# EAGLE design owl-digital (EAGLE 7.5.0)
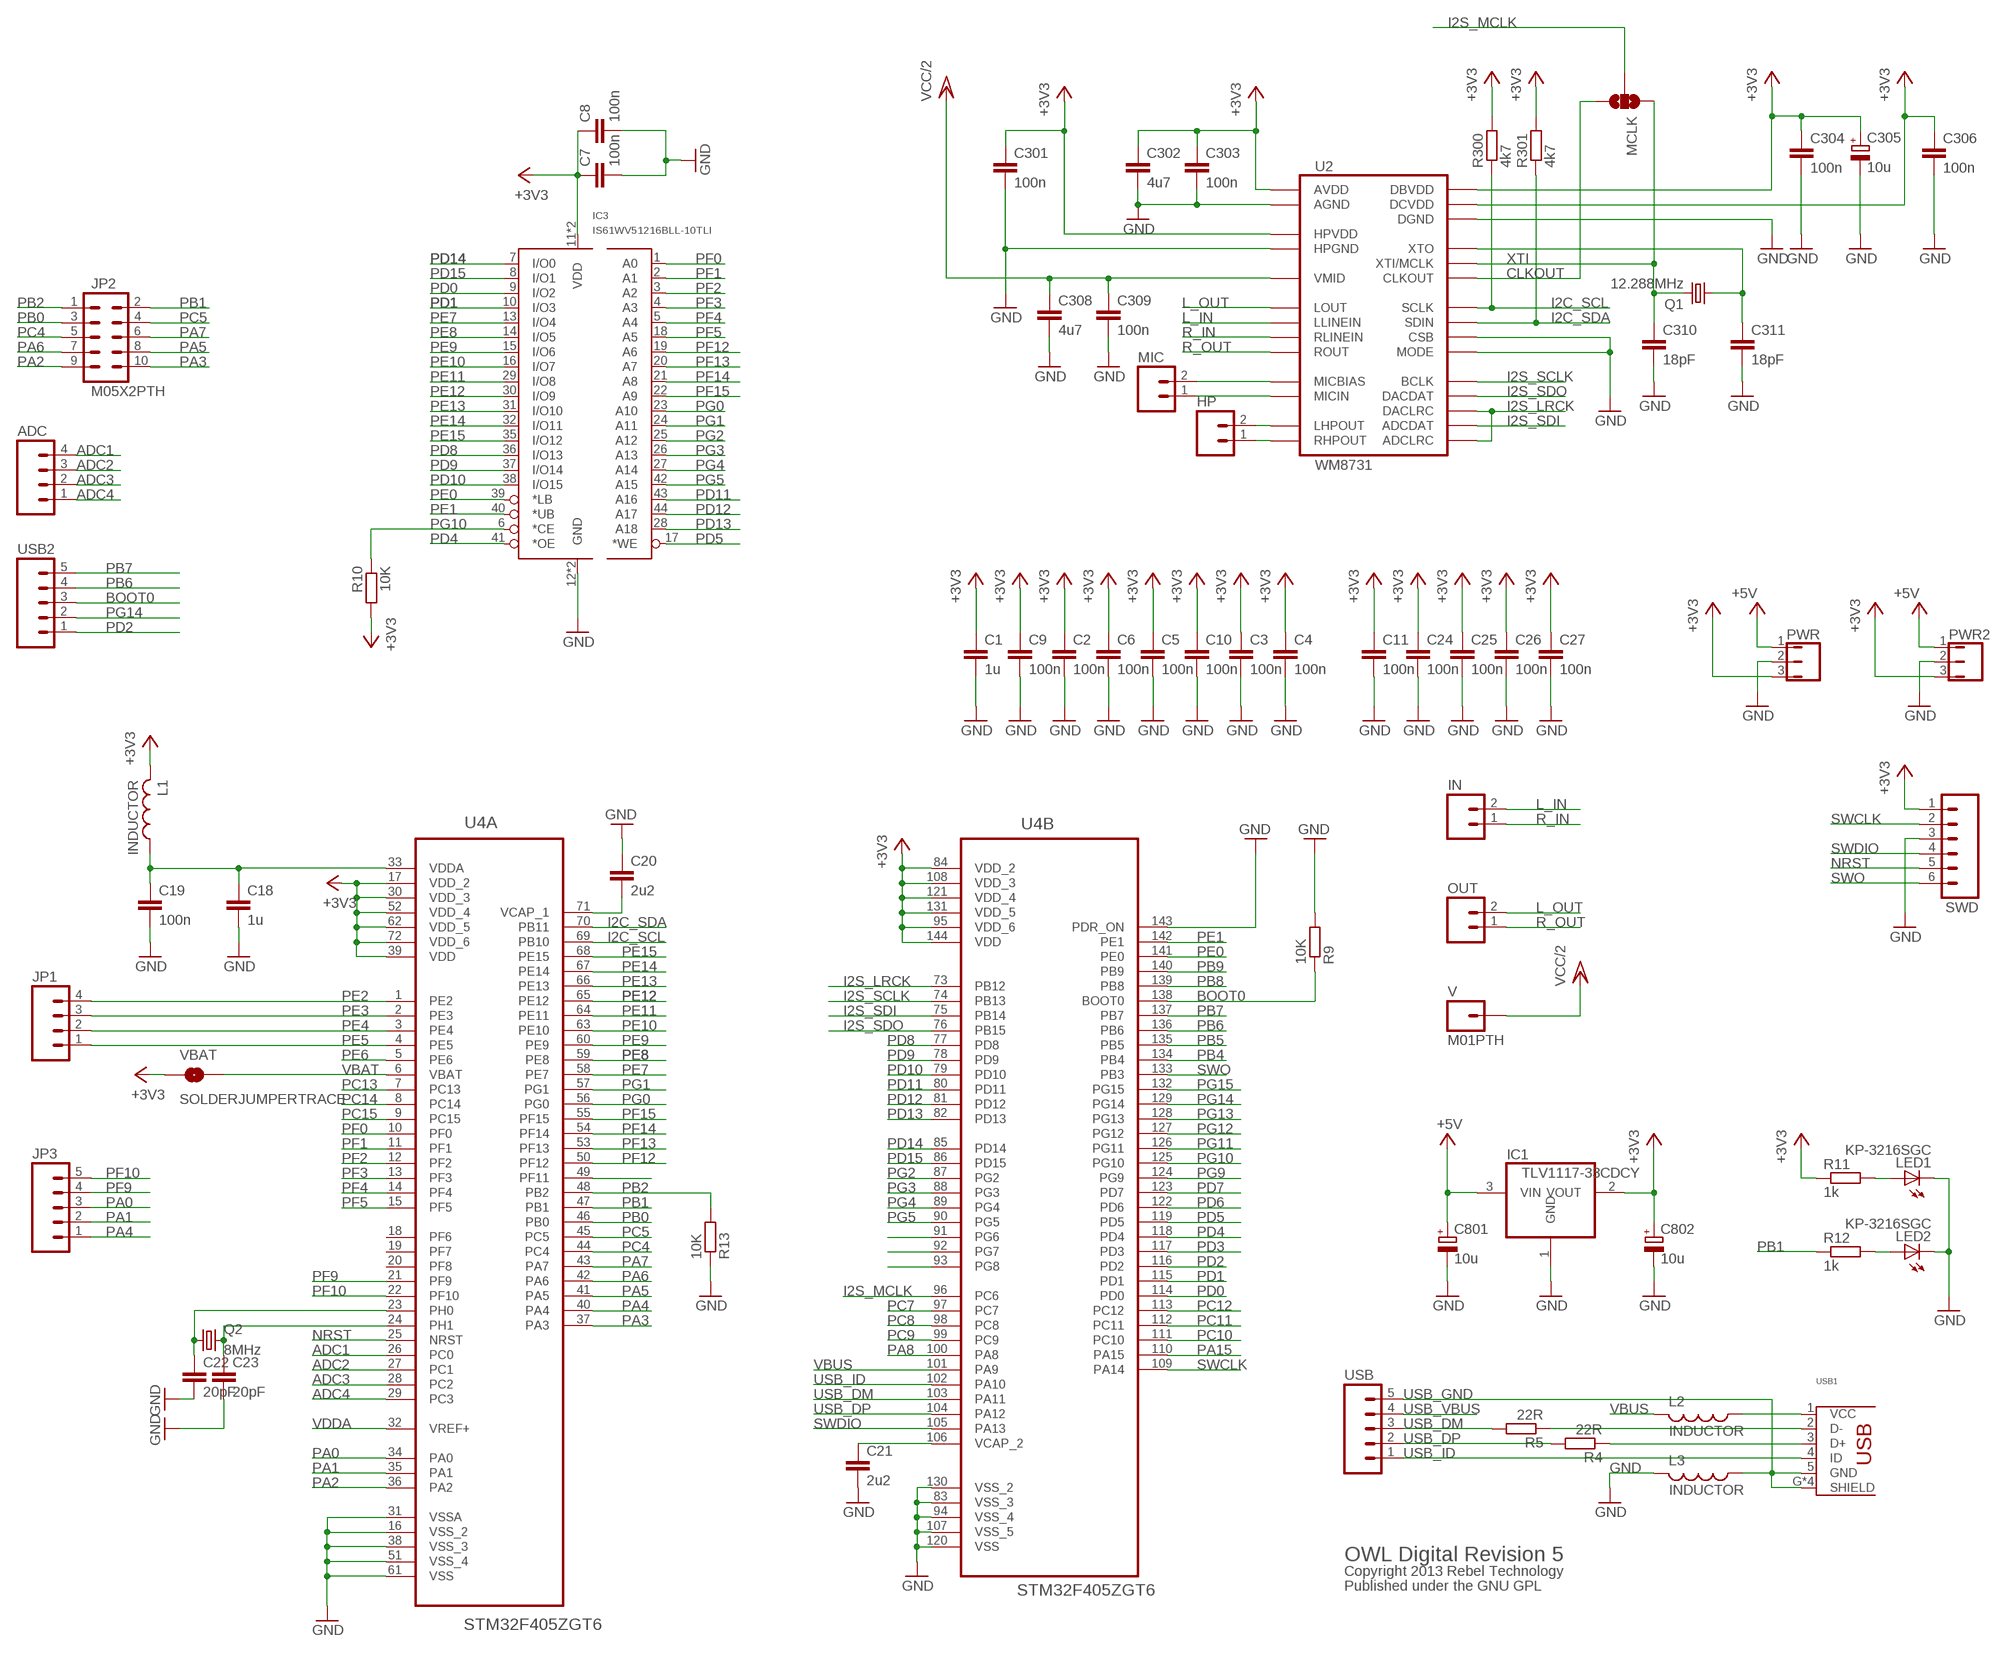
[diagram p0: schematic, sheet 1]

## Parts
ADC  M04PTH  [1X04]
C1  1u  C-EUC0603  [C0603]
C2  100n  C-EUC0603  [C0603]
C3  100n  C-EUC0603  [C0603]
C4  100n  C-EUC0603  [C0603]
C5  100n  C-EUC0603  [C0603]
C6  100n  C-EUC0603  [C0603]
C7  100n  C-EUC0603  [C0603]
C8  100n  C-EUC0603  [C0603]
C9  100n  C-EUC0603  [C0603]
C10  100n  C-EUC0603  [C0603]
C11  100n  C-EUC0603  [C0603]
C18  1u  C-EUC0603  [C0603]
C19  100n  C-EUC0603  [C0603]
C20  2u2  C-EUC0603  [C0603]
C21  2u2  C-EUC0603  [C0603]
C22  20pF  C-EUC0603  [C0603]
C23  20pF  C-EUC0603  [C0603]
C24  100n  C-EUC0603  [C0603]
C25  100n  C-EUC0603  [C0603]
C26  100n  C-EUC0603  [C0603]
C27  100n  C-EUC0603  [C0603]
C301  100n  C-EUC0603  [C0603]
C302  4u7  C-EUC1206  [C1206]
C303  100n  C-EUC0603  [C0603]
C304  100n  C-EUC0603  [C0603]
C305  10u  CPOL-EUA  [PANASONIC_A]
C306  100n  C-EUC0603  [C0603]
C308  4u7  C-EUC1206  [C1206]
C309  100n  C-EUC0603  [C0603]
C310  18pF  C-EUC0603  [C0603]
C311  18pF  C-EUC0603  [C0603]
C801  10u  CPOL-EUA  [PANASONIC_A]
C802  10u  CPOL-EUA  [PANASONIC_A]
HP  M02PTH  [1X02]
IC1  TLV1117-33CDCY  REG1117  [SOT223]
IC3  IS61WV51216BLL-10TLI  [TSOP44-II]
IN  M02PTH  [1X02]
JP1  M04PTH  [1X04]
JP2  M05X2PTH  [AVR_ICSP]
JP3  M05PTH  [1X05]
L1  INDUCTOR  [0603]
L2  INDUCTOR  [0603]
L3  INDUCTOR  [0603]
LED1  KP-3216SGC  LED1206  [LED-1206]
LED2  KP-3216SGC  LED1206  [LED-1206]
MCLK  SOLDERJUMPER_2WAY  [SJ_3_SML]
MIC  M02PTH  [1X02]
OUT  M02PTH  [1X02]
PWR  JMP/3P/SIP  [JMP/3P/SIP]
PWR2  JMP/3P/SIP  [JMP/3P/SIP]
Q1  12.288MHz  CRYSTALHC49UP  [HC49UP]
Q2  8MHz  CRYSTALHC49UP  [HC49UP]
R4  22R  R-EU_0603  [0603]
R5  22R  R-EU_0603  [0603]
R9  10K  R-EU_0603  [0603]
R10  10K  R-EU_0603  [0603]
R11  1k  R-EU_0603  [0603]
R12  1k  R-EU_0603  [0603]
R13  10K  R-EU_0603  [0603]
R300  4k7  R-EU_0603  [0603]
R301  4k7  R-EU_0603  [0603]
SWD  M06SIP  [1X06]
U2  WM8731  [28-SSOP]
U4  STM32F405ZGT6  [QFP50P2200X2200X160-144N]
USB  M05PTH  [1X05]
USB1  USB_HRS_ZX62-B-5PA(11)MICRO.B  [HRS_ZX62RD-AB-5P8]
USB2  M05PTH  [1X05]
V  M01PTH  [1X01]
VBAT  SOLDERJUMPERTRACE  [SJ_2S-TRACE]

## Nets
+3V3: C1.1 C2.1 C3.1 C4.1 C5.1 C6.1 C7.1 C8.1 C9.1 C10.1 C11.1 C24.1 C25.1 C26.1 C27.1 C301.1 C302.1 C303.1 C304.1 C305.+ C306.1 C802.+ IC1.2(VOUT) IC3.11(VDD) IC3.33(VDD) L1.2 PWR2.3 PWR.3 R10.2 R11.1 R300.2 R301.2 SWD.1 U2.P$1(DBVDD) U2.P$8(HPVDD) U2.P$14(AVDD) U2.P$27(DCVDD) U4.17(A:VDD_2) U4.30(A:VDD_3) U4.39(A:VDD) U4.52(A:VDD_4) U4.62(A:VDD_5) U4.72(A:VDD_6) U4.84(B:VDD_2) U4.95(B:VDD_6) U4.108(B:VDD_3) U4.121(B:VDD_4) U4.131(B:VDD_5) U4.144(B:VDD) VBAT.1
+5V: C801.+ IC1.3(VIN) PWR2.1 PWR.1
ADC1: ADC.4 U4.26(A:PC0)
ADC2: ADC.3 U4.27(A:PC1)
ADC3: ADC.2 U4.28(A:PC2)
ADC4: ADC.1 U4.29(A:PC3)
BOOT0: R9.1 U4.138(B:BOOT0) USB2.3
CLKOUT: MCLK.3 U2.P$2(CLKOUT)
GND: C1.2 C2.2 C3.2 C4.2 C5.2 C6.2 C7.2 C8.2 C9.2 C10.2 C11.2 C18.2 C19.2 C20.1 C21.2 C22.2 C23.2 C24.2 C25.2 C26.2 C27.2 C301.2 C302.2 C303.2 C304.2 C305.- C306.2 C308.2 C309.2 C310.2 C311.2 C801.- C802.- IC1.1(GND) IC3.12(GND) IC3.34(GND) L3.2 LED1.C LED2.C PWR2.2 PWR.2 R9.2 R13.1 SWD.3 U2.P$11(HPGND) U2.P$15(AGND) U2.P$21(MODE) U2.P$22(CSB) U2.P$28(DGND) U4.16(A:VSS_2) U4.31(A:VSSA) U4.38(A:VSS_3) U4.51(A:VSS_4) U4.61(A:VSS) U4.83(B:VSS_3) U4.94(B:VSS_4) U4.107(B:VSS_5) U4.120(B:VSS) U4.130(B:VSS_2) U4.143(B:PDR_ON)
I2C_SCL: R300.1 U2.P$24(SCLK) U4.69(A:PB10)
I2C_SDA: R301.1 U2.P$23(SDIN) U4.70(A:PB11)
I2S_LRCK: U2.P$5(DACLRC) U2.P$7(ADCLRC) U4.73(B:PB12)
I2S_MCLK: MCLK.2 U4.96(B:PC6)
I2S_SCLK: U2.P$3(BCLK) U4.74(B:PB13)
I2S_SDI: U2.P$6(ADCDAT) U4.75(B:PB14)
I2S_SDO: U2.P$4(DACDAT) U4.76(B:PB15)
L_IN: IN.2 U2.P$20(LLINEIN)
L_OUT: OUT.2 U2.P$12(LOUT)
LHPOUT: HP.2 U2.P$9(LHPOUT)
MICBIAS: MIC.2 U2.P$17(MICBIAS)
MICIN: MIC.1 U2.P$18(MICIN)
N$2: C311.1 Q1.1 U2.P$26(XTO)
N$6: U4.49(A:PF11)
N$10: LED1.A R11.2
N$11: LED2.A R12.2
N$17: R4.1 USB1.3(D+)
N$21: R5.1 USB1.2(D-)
N$23: C23.1 Q2.2 U4.24(A:PH1)
N$24: C22.1 Q2.1 U4.23(A:PH0)
N$54: U4.91(B:PG6)
N$142: U4.93(B:PG8)
N$143: U4.92(B:PG7)
NRST: SWD.5 U4.25(A:NRST)
PA0: JP3.3 U4.34(A:PA0)
PA1: JP3.2 U4.35(A:PA1)
PA2: JP2.9 U4.36(A:PA2)
PA3: JP2.10 U4.37(A:PA3)
PA4: JP3.1 U4.40(A:PA4)
PA5: JP2.8 U4.41(A:PA5)
PA6: JP2.7 U4.42(A:PA6)
PA7: JP2.6 U4.43(A:PA7)
PA8: U4.100(B:PA8)
PA15: U4.110(B:PA15)
PB0: JP2.3 U4.46(A:PB0)
PB1: JP2.2 R12.1 U4.47(A:PB1)
PB2: JP2.1 R13.2 U4.48(A:PB2)
PB4: U4.134(B:PB4)
PB5: U4.135(B:PB5)
PB6: U4.136(B:PB6) USB2.4
PB7: U4.137(B:PB7) USB2.5
PB8: U4.139(B:PB8)
PB9: U4.140(B:PB9)
PC4: JP2.5 U4.44(A:PC4)
PC5: JP2.4 U4.45(A:PC5)
PC7: U4.97(B:PC7)
PC8: U4.98(B:PC8)
PC9: U4.99(B:PC9)
PC10: U4.111(B:PC10)
PC11: U4.112(B:PC11)
PC12: U4.113(B:PC12)
PC13: U4.7(A:PC13)
PC14: U4.8(A:PC14)
PC15: U4.9(A:PC15)
PD0: IC3.9(I/O2) U4.114(B:PD0)
PD1: IC3.10(I/O3) U4.115(B:PD1)
PD2: U4.116(B:PD2) USB2.1
PD3: U4.117(B:PD3)
PD4: IC3.41(*OE) U4.118(B:PD4)
PD5: IC3.17(*WE) U4.119(B:PD5)
PD6: U4.122(B:PD6)
PD7: U4.123(B:PD7)
PD8: IC3.36(I/O13) U4.77(B:PD8)
PD9: IC3.37(I/O14) U4.78(B:PD9)
PD10: IC3.38(I/O15) U4.79(B:PD10)
PD11: IC3.43(A16) U4.80(B:PD11)
PD12: IC3.44(A17) U4.81(B:PD12)
PD13: IC3.28(A18) U4.82(B:PD13)
PD14: IC3.7(I/O0) U4.85(B:PD14)
PD15: IC3.8(I/O1) U4.86(B:PD15)
PE0: IC3.39(*LB) U4.141(B:PE0)
PE1: IC3.40(*UB) U4.142(B:PE1)
PE2: JP1.4 U4.1(A:PE2)
PE3: JP1.3 U4.2(A:PE3)
PE4: JP1.2 U4.3(A:PE4)
PE5: JP1.1 U4.4(A:PE5)
PE6: U4.5(A:PE6)
PE7: IC3.13(I/O4) U4.58(A:PE7)
PE8: IC3.14(I/O5) U4.59(A:PE8)
PE9: IC3.15(I/O6) U4.60(A:PE9)
PE10: IC3.16(I/O7) U4.63(A:PE10)
PE11: IC3.29(I/O8) U4.64(A:PE11)
PE12: IC3.30(I/O9) U4.65(A:PE12)
PE13: IC3.31(I/O10) U4.66(A:PE13)
PE14: IC3.32(I/O11) U4.67(A:PE14)
PE15: IC3.35(I/O12) U4.68(A:PE15)
PF0: IC3.1(A0) U4.10(A:PF0)
PF1: IC3.2(A1) U4.11(A:PF1)
PF2: IC3.3(A2) U4.12(A:PF2)
PF3: IC3.4(A3) U4.13(A:PF3)
PF4: IC3.5(A4) U4.14(A:PF4)
PF5: IC3.18(A5) U4.15(A:PF5)
PF9: JP3.4 U4.21(A:PF9)
PF10: JP3.5 U4.22(A:PF10)
PF12: IC3.19(A6) U4.50(A:PF12)
PF13: IC3.20(A7) U4.53(A:PF13)
PF14: IC3.21(A8) U4.54(A:PF14)
PF15: IC3.22(A9) U4.55(A:PF15)
PG0: IC3.23(A10) U4.56(A:PG0)
PG1: IC3.24(A11) U4.57(A:PG1)
PG2: IC3.25(A12) U4.87(B:PG2)
PG3: IC3.26(A13) U4.88(B:PG3)
PG4: IC3.27(A14) U4.89(B:PG4)
PG5: IC3.42(A15) U4.90(B:PG5)
PG9: U4.124(B:PG9)
PG10: IC3.6(*CE) R10.1 U4.125(B:PG10)
PG11: U4.126(B:PG11)
PG12: U4.127(B:PG12)
PG13: U4.128(B:PG13)
PG14: U4.129(B:PG14) USB2.2
PG15: U4.132(B:PG15)
R_IN: IN.1 U2.P$19(RLINEIN)
R_OUT: OUT.1 U2.P$13(ROUT)
RHPOUT: HP.1 U2.P$10(RHPOUT)
SWCLK: SWD.2 U4.109(B:PA14)
SWDIO: SWD.4 U4.105(B:PA13)
SWO: SWD.6 U4.133(B:PB3)
USB_DM: R5.2 U4.103(B:PA11) USB.3
USB_DP: R4.2 U4.104(B:PA12) USB.2
USB_GND: L3.1 USB1.5(GND) USB1.G2(SHIELD) USB1.G3(SHIELD) USB1.G4(SHIELD) USB1.G(SHIELD) USB.5
USB_ID: U4.102(B:PA10) USB1.4(ID) USB.1
USB_VBUS: L2.1 USB1.1(VCC) USB.4
VBAT: U4.6(A:VBAT) VBAT.2
VBUS: L2.2 U4.101(B:PA9)
VCAP1: C20.2 U4.71(A:VCAP_1)
VCAP2: C21.1 U4.106(B:VCAP_2)
VCC/2: C308.1 C309.1 U2.P$16(VMID) V.1
VDDA: C18.1 C19.1 L1.1 U4.32(A:VREF+) U4.33(A:VDDA)
XTI: C310.1 MCLK.1 Q1.2 U2.P$25(XTI/MCLK)
Unconnected: U4.18(A:PF6) U4.19(A:PF7) U4.20(A:PF8)

## Notes on the sheet
- OWL Digital Revision 5
- Copyright 2013 Rebel Technology
- Published under the GNU GPL

## Library data of the parts
ADC JP1 = SparkFun:M04: Header 4 Standard 4-pin 0.1" header. Use with straight break away headers (SKU : PRT-00116), right angle break away headers (PRT-00553), swiss pins (PRT-00743), machine pins (PRT-00117), and female headers (PRT-00115). Molex polarized connector foot print use with SKU : PRT-08231 with associated crimp pins and housings. 1MM SMD Version SKU: PRT-10208
C1-C11 C18 C19 C22-C27 C301-C304 C306 C308 C309 = resistor:C-EU: CAPACITOR, European symbol
C20 C21 = resistor:C-EU: CAPACITOR, European symbol; FARNELL: 184-5734
C305 = resistor:CPOL-EU: POLARIZED CAPACITOR, European symbol
C310 C311 = resistor:C-EU: CAPACITOR, European symbol; FARNELL: 182-8908
C801 C802 = resistor:CPOL-EU: POLARIZED CAPACITOR, European symbol; FARNELL: 882-3014
HP IN MIC OUT = SparkFun:M02: Header 2 Standard 2-pin 0.1" header. Use with straight break away headers (SKU : PRT-00116), right angle break away headers (PRT-00553), swiss pins (PRT-00743), machine pins (PRT-00117), and female headers (PRT-00115). Molex polarized connector foot print use with SKU : PRT-08233 with associated crimp pins and housings.
IC1 = burr-brown:REG1117: 800mA and 1A Low Dropout (LDO) Positive Regulator 1.8V, 2.5V, 2.85V, 3.3V, 5V, and Adj; FARNELL: 149-4942; MPN: REG1117; OC_FARNELL: 1097566; OC_NEWARK: 14P6981
IC3 = Rebel:IS61WV51216BLL-10TLI: IS61WV51216BLL-10TLI - SRAM, 8MBIT, 10NS, 44TSOPII Manufacturer: INTEGRATED SILICON SOLUTION (ISSI) Farnell order code: 2253837 Manufacturer Part No: IS61WV51216BLL-10TLI Product Information SRAM, 8MBIT, 10NS, 44TSOPII Memory Size: 8Mbit Memory Configuration: 512K x 16bit Supply Voltage Min: 2.4V Supply Voltage Max: 3.6V Memory Case Style: TSOPII No. of Pins: 44 Access Time: 10ns Operating Temperature Min: -40°C Operating Temperature Max: 85°C MSL: MSL 3 - 168 hours SVHC: No SVHC (19-Dec-2012) Operating Temperature Range: -40°C to +85°C Supply Voltage Range: 2.4V to 3.6V; FARNELL: 225-3837
JP2 = SparkFun:M05X2: Header 5x2 Standard 10-pin dual row 0.1" header. Commonly used with AVR-ISP. Use with Spark Fun Electronics SKU: PRT-00778
JP3 USB USB2 = SparkFun:M05: Header 5 Standard 5-pin 0.1" header. Use with straight break away headers (SKU : PRT-00116), right angle break away headers (PRT-00553), swiss pins (PRT-00743), machine pins (PRT-00117), and female headers (PRT-00115). Molex polarized connector foot print use with SKU : PRT-08230 with associated crimp pins and housings.
L1 = Rebel:INDUCTOR; FARNELL: 161-1981
L2 L3 = Rebel:INDUCTOR
LED1 LED2 = SparkFun:LED: LEDs Standard schematic elements and footprints for 5mm, 3mm, 1206, and 0603 sized LEDs. 5mm - Spark Fun Electronics SKU : COM-00529 (and others); FARNELL: 853-0033
MCLK = SparkFun:SOLDERJUMPER_2WAY: Solder Jumper 2 way solder jumper
PWR PWR2 = audioint:JMP/3P/SIP
Q1 = crystal:CRYSTAL: CRYSTAL; FARNELL: 184-2283; OC_FARNELL: unknown; OC_NEWARK: unknown
Q2 = crystal:CRYSTAL: CRYSTAL; FARNELL: 206-3972; OC_FARNELL: unknown; OC_NEWARK: unknown
R4 R5 R9-R13 R300 R301 = Rebel:R-EU_: RESISTOR, European symbol
SWD = SparkFun:M06: Header 6 Standard 6-pin 0.1" header. Use with straight break away headers (SKU : PRT-00116), right angle break away headers (PRT-00553), swiss pins (PRT-00743), machine pins (PRT-00117), and female headers (PRT-00115). Molex polarized connector foot print use with SKU : PRT-08094 with associated crimp pins and housings. NOTES ON THE VARIANTS LOCK and LOCK_LONGPADS... This footprint was designed to help hold the alignment of a through-hole component (i.e. 6-pin header) while soldering it into place. You may notice that each hole has been shifted either up or down by 0.005 of an inch from it's more standard position (which is a perfectly straight line). This slight alteration caused the pins (the squares in the middle) to touch the edges of the holes. Because they are alternating, it causes a "brace" to hold the component in place. 0.005 has proven to be the perfect amount of "off-center" position when using our standard breakaway headers. Although looks a little odd when you look at the bare footprint, once you have a header in there, the alteration is very hard to notice. Also, if you push a header all the way into place, it is covered up entirely on the bottom side. This idea of altering the position of holes to aid alignment will be further integrated into the Sparkfun Library for other footprints. It can help hold any component with 3 or more connection pins.
U2 = audioint:WM8731; FARNELL: 177-6264
U4 = Rebel:STM32F405ZGT6: IC, MCU, 32BIT, 1MB FLASH, 144LQFP; FARNELL: 221-5225; MPN: STM32F405ZGT6; OC_FARNELL: 2215225; OC_NEWARK: 46W2200; PACKAGE: 144LQFP; SUPPLIER: STMicroelectronics
USB1 = Rebel:USB_HRS_ZX62-B-5PA(11)MICRO.B; FARNELL: 230-0440
V = SparkFun:M01: Header 1 Standard 1-pin 0.1" header. Use with straight break away headers (SKU : PRT-00116), right angle break away headers (PRT-00553), swiss pins (PRT-00743), machine pins (PRT-00117), and female headers (PRT-00115).
VBAT = SparkFun:SOLDERJUMPER: Solder Jumper Standard SMD solder jumper. Used to automate production. Two varients : Normally Open and Normally Closed are the same, but have different paste layers. NC will have a large amount of paste and should jumper during reflow.

## Board
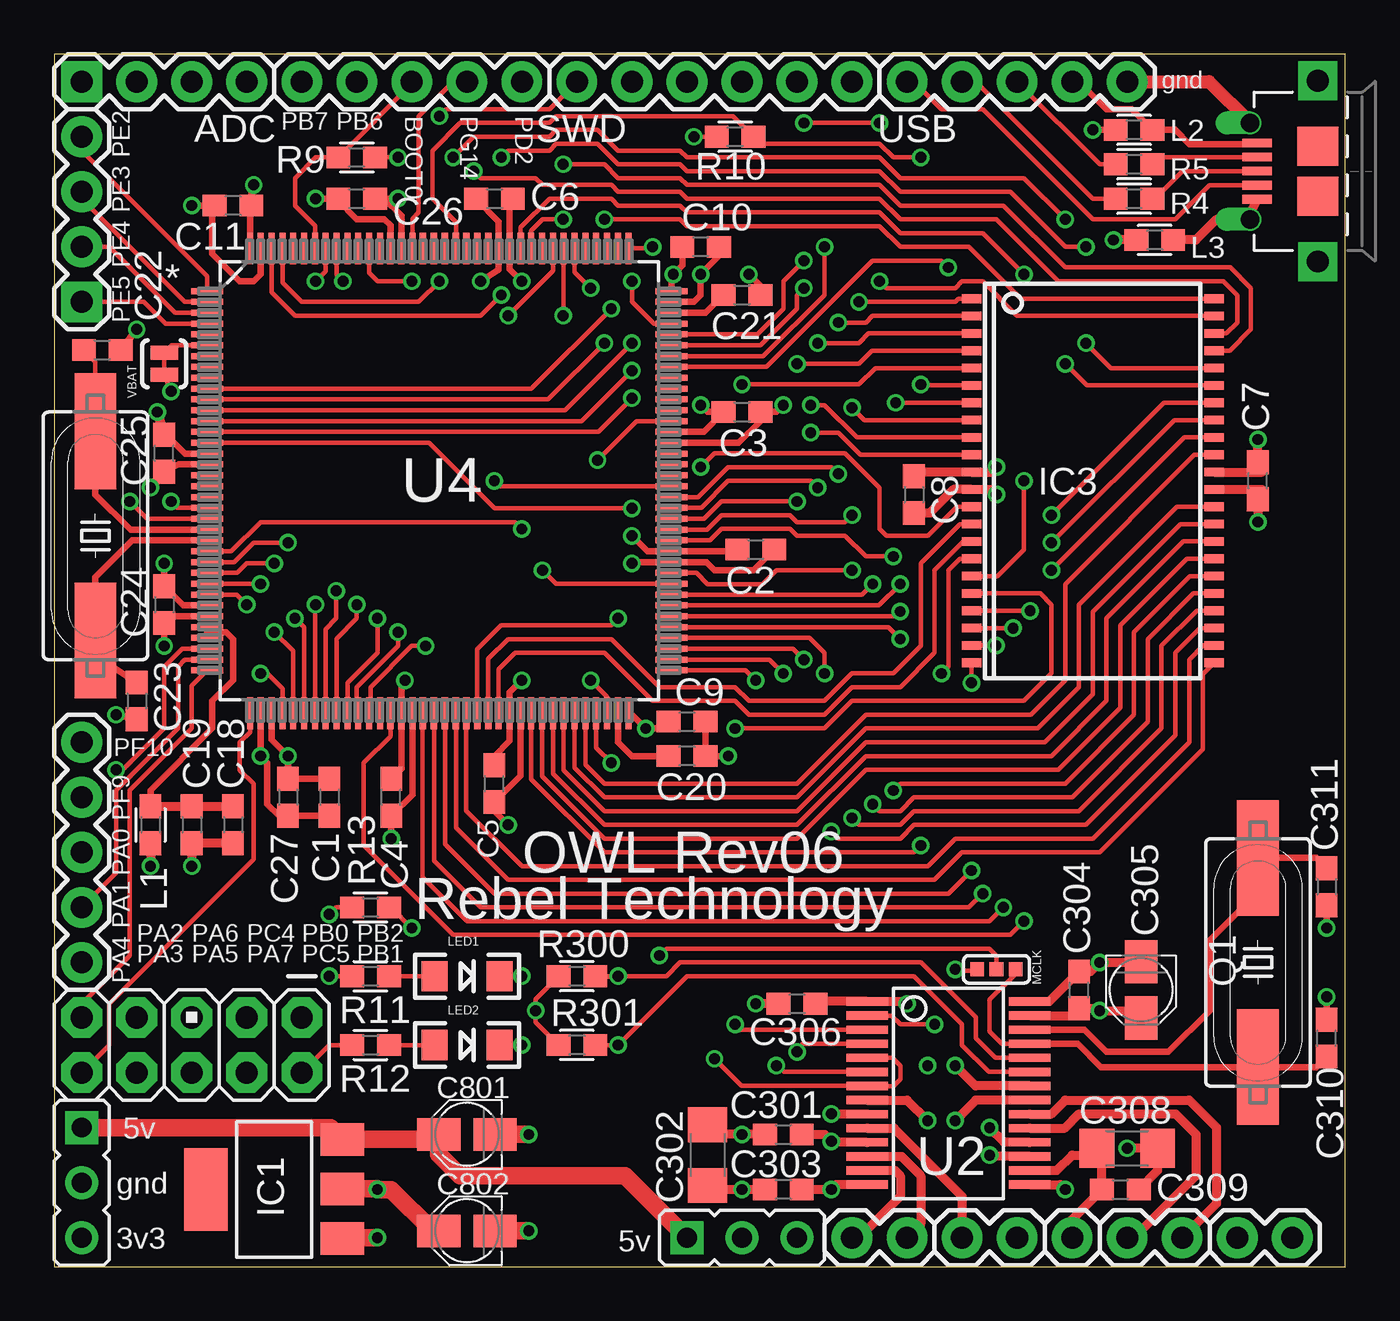
[diagram p1: board, top side]
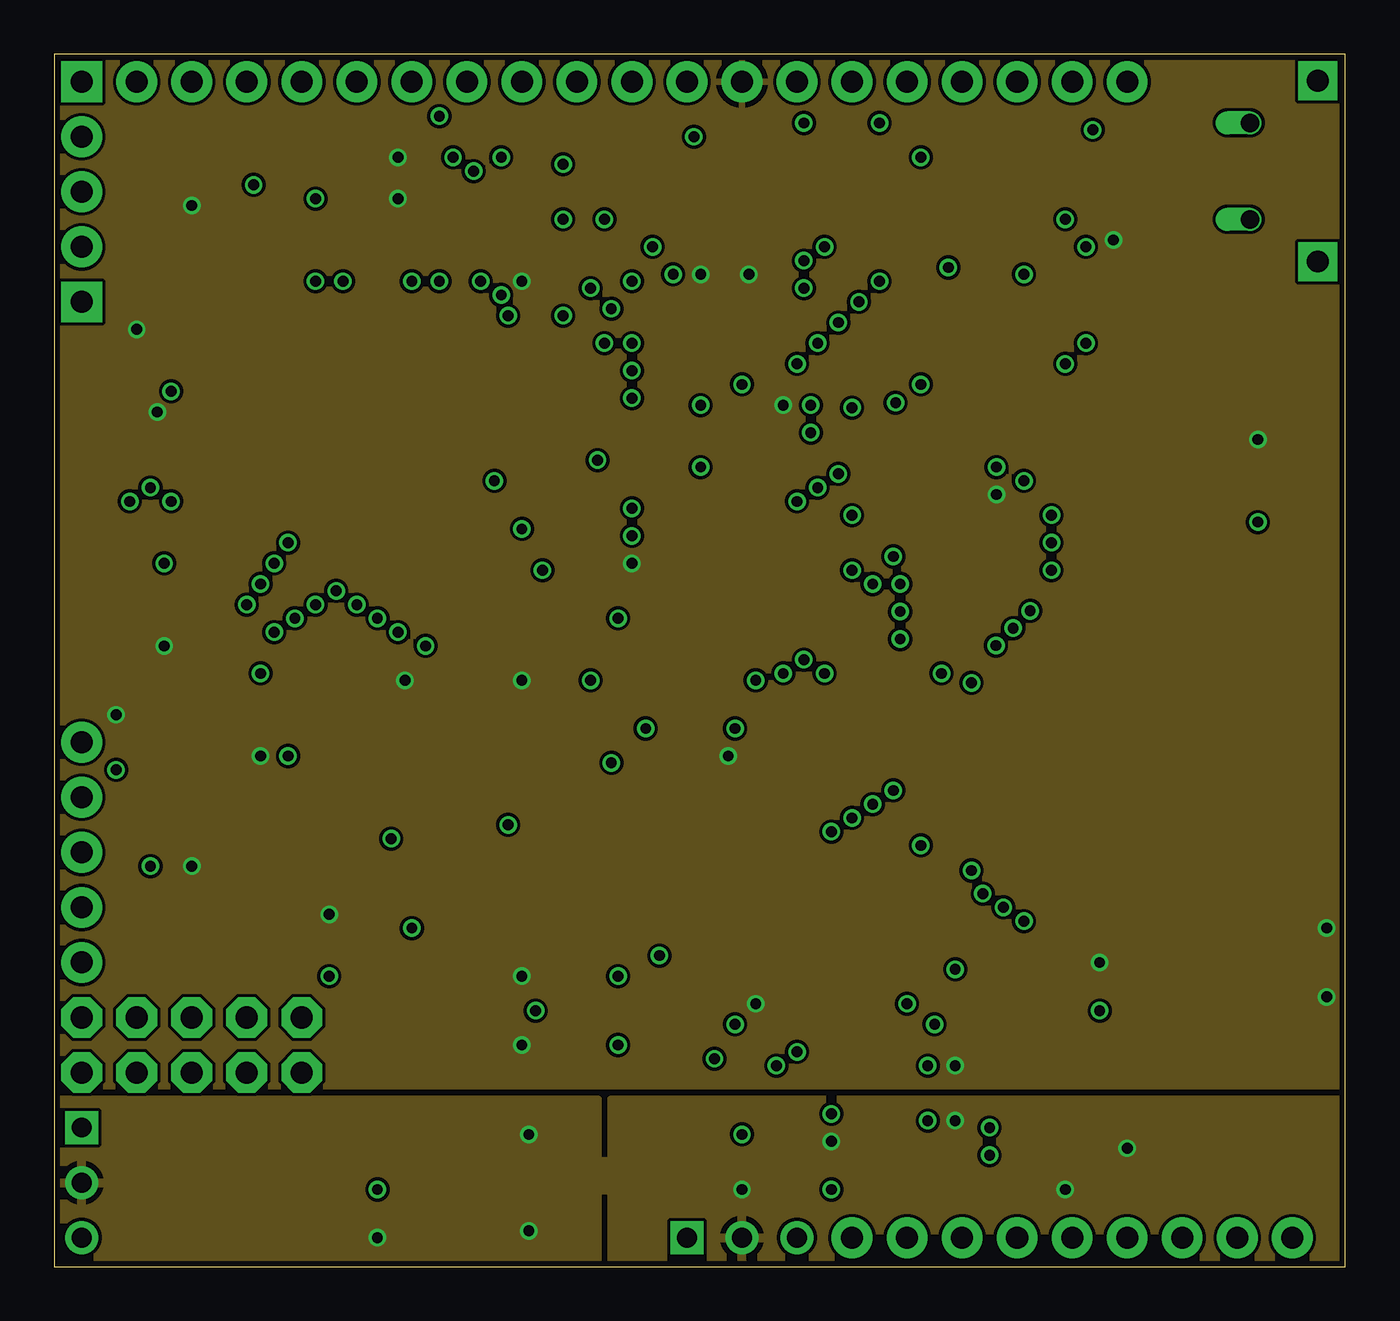
[diagram p2: board, inner layer Ground]
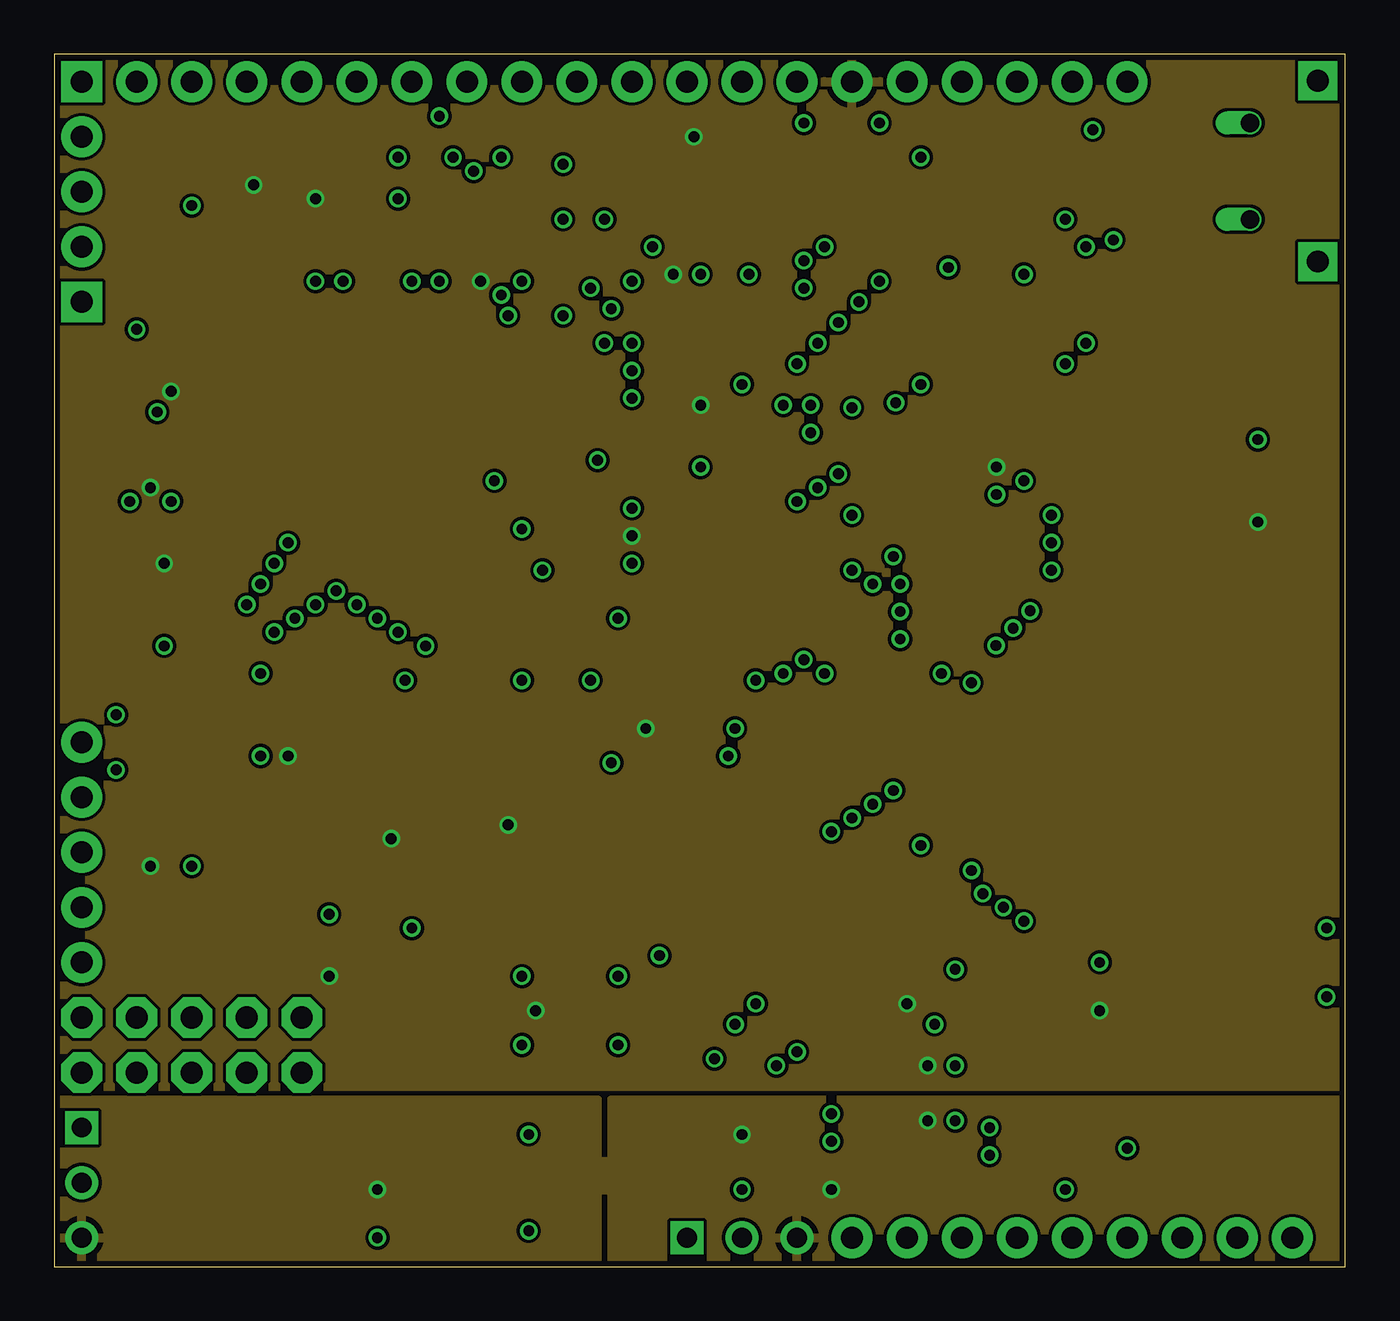
[diagram p3: board, inner layer Power]
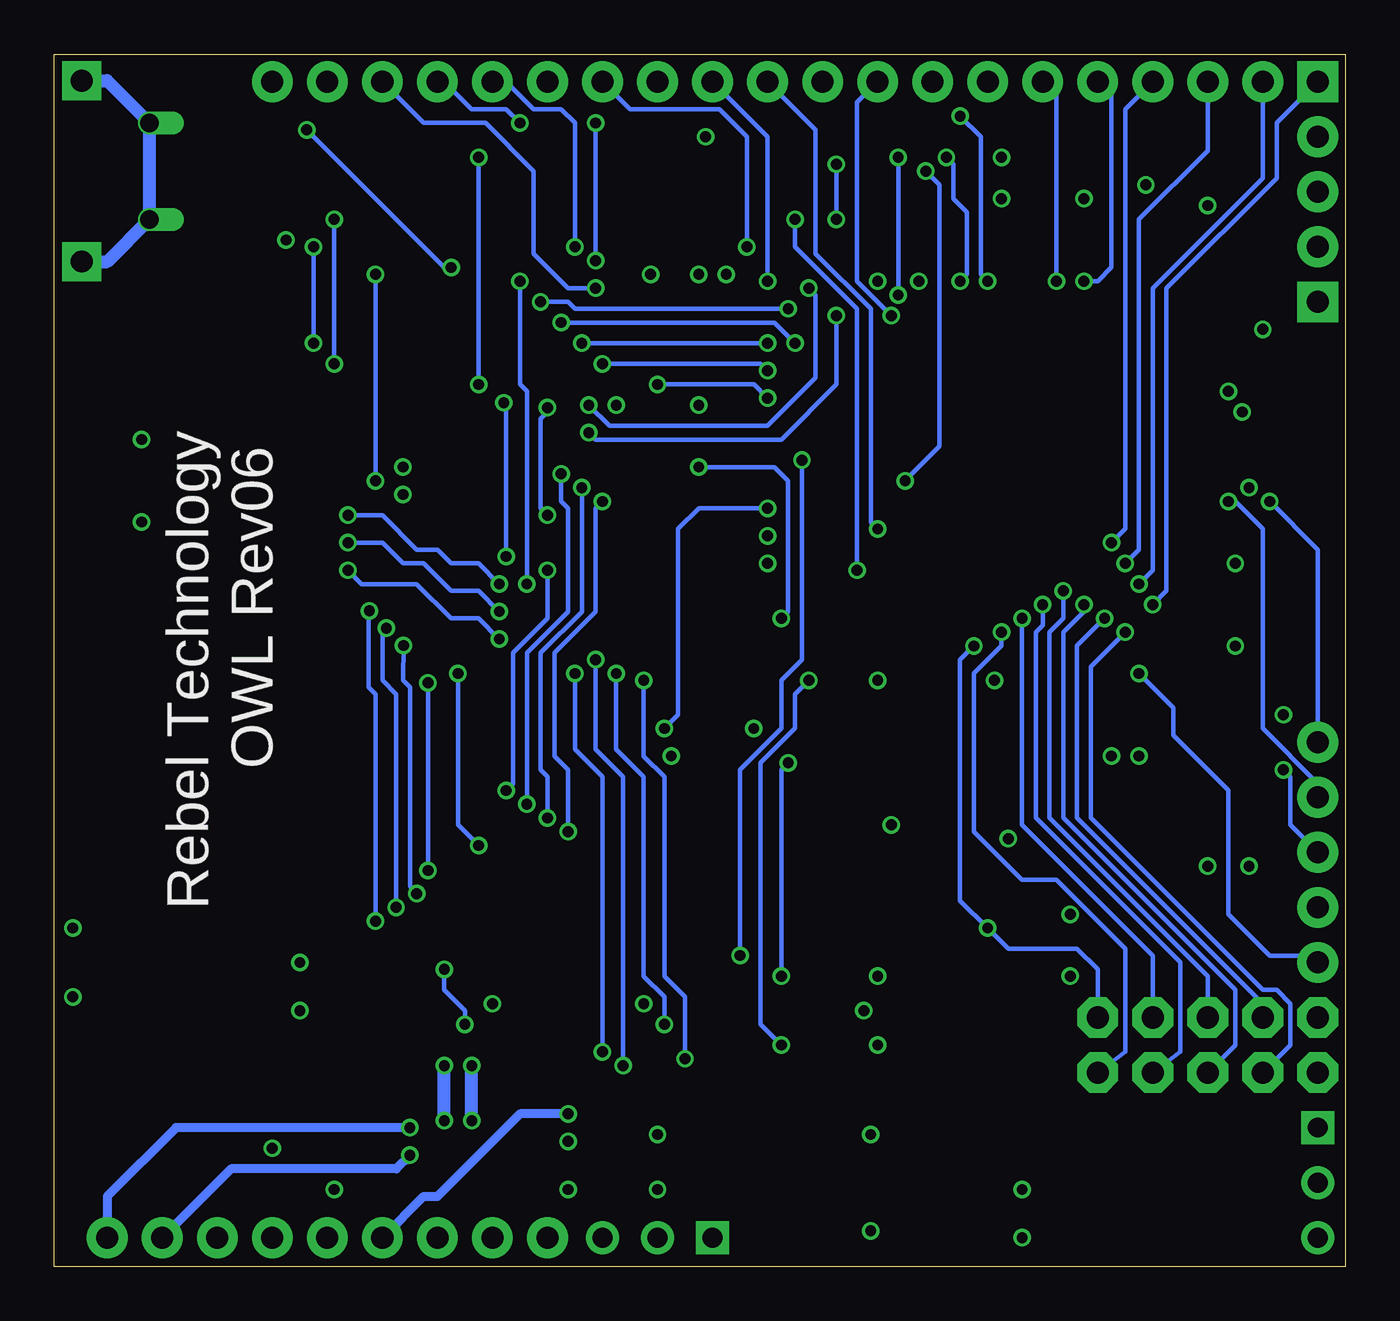
[diagram p4: board, bottom side, seen from below]

Size 59.6 x 55.94 mm. Coordinates in mm from the lower left corner, seen from the top.
Outline: 0,0 59.6,0 59.6,55.94 0,55.94 0,0
Copper layers (1*2+15*16): Top 0.035mm / dielectric 1.5mm / Ground 0.035mm / dielectric 0.15mm / Power 0.035mm / dielectric 0.2mm / Bottom 0.035mm
Design rules "Rebel *": minimum track width 6mil, minimum drill 12mil, track to track 6mil, track to pad 6mil, pad to pad 6mil, via to via 6mil, smd to smd 0mil, copper to edge 10mil, drill to drill 10mil, minimum pad ring 4mil, minimum via ring 6mil, stop-mask expansion 2mil, vias tented up to drill 100mil, thermal gap 10mil

### Footprints (pad centres in the part's own frame; a part is rotated, then mirrored left to right if it is on the bottom)
1X04 = drill 1.016 pad 1.88 square: 1 0,0 | drill 1.016 pad 1.88: 2 2.54,0; 3 5.08,0; 4 7.62,0
C0603 = smd 1.1 x 1: 1 -0.85,0; 2 0.85,0
C1206 = smd 1.6 x 1.8: 1 -1.4,0; 2 1.4,0
PANASONIC_A = smd 2 x 1.5: + 1.3,0; - -1.3,0
1X02 = drill 1.016 pad 1.88: 1 0,0; 2 2.54,0
SOT223 = smd 1.499 x 2.007: 1 -2.261,-3.15; 2 0.025,-3.15; 3 2.311,-3.15 | smd 3.81 x 2.007: 4 0,3.15
TSOP44-II = smd 0.4 x 0.9: 1 -8.4,-5.6; 2 -7.6,-5.6; 3 -6.8,-5.6; 4 -6,-5.6; 5 -5.2,-5.6; 6 -4.4,-5.6; 7 -3.6,-5.6; 8 -2.8,-5.6; 9 -2,-5.6; 10 -1.2,-5.6; 11 -0.4,-5.6; 12 0.4,-5.6; 13 1.2,-5.6; 14 2,-5.6; 15 2.8,-5.6; 16 3.6,-5.6; 17 4.4,-5.6; 18 5.2,-5.6; 19 6,-5.6; 20 6.8,-5.6; 21 7.6,-5.6; 22 8.4,-5.6; 23 8.4,5.6; 24 7.6,5.6; 25 6.8,5.6; 26 6,5.6; 27 5.2,5.6; 28 4.4,5.6; 29 3.6,5.6; 30 2.8,5.6; 31 2,5.6; 32 1.2,5.6; 33 0.4,5.6; 34 -0.4,5.6; 35 -1.2,5.6; 36 -2,5.6; 37 -2.8,5.6; 38 -3.6,5.6; 39 -4.4,5.6; 40 -5.2,5.6; 41 -6,5.6; 42 -6.8,5.6; 43 -7.6,5.6; 44 -8.4,5.6
AVR_ICSP = drill 1.016 pad 1.88 octagon: 1 -1.27,5.08; 2 1.27,5.08; 3 -1.27,2.54; 4 1.27,2.54; 5 -1.27,0; 6 1.27,0; 7 -1.27,-2.54; 8 1.27,-2.54; 9 -1.27,-5.08; 10 1.27,-5.08
1X05 = drill 1.016 pad 1.88: 1 0,0; 2 2.54,0; 3 5.08,0; 4 7.62,0; 5 10.16,0
0603 = smd 1.1 x 1: 1 -0.85,0; 2 0.85,0
LED-1206 = smd 1.2 x 1.4: A -1.5,0; C 1.5,0
SJ_3_SML = smd 0.635 x 0.635: 1 -0.889,0; 2 0,0; 3 0.889,0
JMP/3P/SIP = drill 0.914 pad 1.524 square: 1 -2.54,0 | drill 0.914 pad 1.524: 2 0,0; 3 2.54,0
HC49UP = smd 5.334 x 1.93: 1 -4.826,0; 2 4.826,0
1X06 = drill 1.016 pad 1.88: 1 0,0; 2 2.54,0; 3 5.08,0; 4 7.62,0; 5 10.16,0; 6 12.7,0
28-SSOP = smd 0.381 x 1.905: P$1 -4.55,-3.752; P$2 -3.9,-3.752; P$3 -3.25,-3.752; P$4 -2.6,-3.752; P$5 -1.95,-3.752; P$6 -1.3,-3.752; P$7 -0.65,-3.752; P$8 0,-3.752; P$9 0.65,-3.752; P$10 1.3,-3.752; P$11 1.95,-3.752; P$12 2.6,-3.752; P$13 3.25,-3.752; P$14 3.9,-3.752; P$15 3.9,3.752; P$16 3.25,3.752; P$17 2.6,3.752; P$18 1.95,3.752; P$19 1.3,3.752; P$20 0.65,3.752; P$21 0,3.752; P$22 -0.65,3.752; P$23 -1.3,3.752; P$24 -1.95,3.752; P$25 -2.6,3.752; P$26 -3.25,3.752; P$27 -3.9,3.752; P$28 -4.55,3.752
QFP50P2200X2200X160-144N = smd 1.473 x 0.279: 1 -10.719,8.738; 2 -10.719,8.255; 3 -10.719,7.747; 4 -10.719,7.239; 5 -10.719,6.756; 6 -10.719,6.248; 7 -10.719,5.74; 8 -10.719,5.258; 9 -10.719,4.75; 10 -10.719,4.242; 11 -10.719,3.759; 12 -10.719,3.251; 13 -10.719,2.743; 14 -10.719,2.261; 15 -10.719,1.753; 16 -10.719,1.245; 17 -10.719,0.762; 18 -10.719,0.254; 19 -10.719,-0.254; 20 -10.719,-0.762; 21 -10.719,-1.245; 22 -10.719,-1.753; 23 -10.719,-2.261; 24 -10.719,-2.743; 25 -10.719,-3.251; 26 -10.719,-3.759; 27 -10.719,-4.242; 28 -10.719,-4.75; 29 -10.719,-5.258; 30 -10.719,-5.74; 31 -10.719,-6.248; 32 -10.719,-6.756; 33 -10.719,-7.239; 34 -10.719,-7.747; 35 -10.719,-8.255; 36 -10.719,-8.738; 73 10.719,-8.738; 74 10.719,-8.255; 75 10.719,-7.747; 76 10.719,-7.239; 77 10.719,-6.756; 78 10.719,-6.248; 79 10.719,-5.74; 80 10.719,-5.258; 81 10.719,-4.75; 82 10.719,-4.242; 83 10.719,-3.759; 84 10.719,-3.251; 85 10.719,-2.743; 86 10.719,-2.261; 87 10.719,-1.753; 88 10.719,-1.245; 89 10.719,-0.762; 90 10.719,-0.254; 91 10.719,0.254; 92 10.719,0.762; 93 10.719,1.245; 94 10.719,1.753; 95 10.719,2.261; 96 10.719,2.743; 97 10.719,3.251; 98 10.719,3.759; 99 10.719,4.242; 100 10.719,4.75; 101 10.719,5.258; 102 10.719,5.74; 103 10.719,6.248; 104 10.719,6.756; 105 10.719,7.239; 106 10.719,7.747; 107 10.719,8.255; 108 10.719,8.738 | smd 0.279 x 1.473: 37 -8.738,-10.719; 38 -8.255,-10.719; 39 -7.747,-10.719; 40 -7.239,-10.719; 41 -6.756,-10.719; 42 -6.248,-10.719; 43 -5.74,-10.719; 44 -5.258,-10.719; 45 -4.75,-10.719; 46 -4.242,-10.719; 47 -3.759,-10.719; 48 -3.251,-10.719; 49 -2.743,-10.719; 50 -2.261,-10.719; 51 -1.753,-10.719; 52 -1.245,-10.719; 53 -0.762,-10.719; 54 -0.254,-10.719; 55 0.254,-10.719; 56 0.762,-10.719; 57 1.245,-10.719; 58 1.753,-10.719; 59 2.261,-10.719; 60 2.743,-10.719; 61 3.251,-10.719; 62 3.759,-10.719; 63 4.242,-10.719; 64 4.75,-10.719; 65 5.258,-10.719; 66 5.74,-10.719; 67 6.248,-10.719; 68 6.756,-10.719; 69 7.239,-10.719; 70 7.747,-10.719; 71 8.255,-10.719; 72 8.738,-10.719; 109 8.738,10.719; 110 8.255,10.719; 111 7.747,10.719; 112 7.239,10.719; 113 6.756,10.719; 114 6.248,10.719; 115 5.74,10.719; 116 5.258,10.719; 117 4.75,10.719; 118 4.242,10.719; 119 3.759,10.719; 120 3.251,10.719; 121 2.743,10.719; 122 2.261,10.719; 123 1.753,10.719; 124 1.245,10.719; 125 0.762,10.719; 126 0.254,10.719; 127 -0.254,10.719; 128 -0.762,10.719; 129 -1.245,10.719; 130 -1.753,10.719; 131 -2.261,10.719; 132 -2.743,10.719; 133 -3.251,10.719; 134 -3.759,10.719; 135 -4.242,10.719; 136 -4.75,10.719; 137 -5.258,10.719; 138 -5.74,10.719; 139 -6.248,10.719; 140 -6.756,10.719; 141 -7.239,10.719; 142 -7.747,10.719; 143 -8.255,10.719; 144 -8.738,10.719
HRS_ZX62RD-AB-5P8 = smd 0.4 x 1.35: 1 1.3,2.275; 2 0.65,2.275; 3 0,2.275; 4 -0.65,2.275; 5 -1.3,2.275 | smd 1.8 x 1.9: D_0 -1.15,-0.525; D_1 1.15,-0.525 | drill 1 pad 1.8 square: G -4.175,-0.525; G2 4.175,-0.525 | drill 0.85 pad 1.016 offset: G3 -2.225,2.6; G4 2.225,2.6
1X01 = drill 1.016 pad 1.88: 1 0,0
SJ_2S-TRACE = smd 0.635 x 1.27: 1 -0.508,0; 2 0.508,0

### Placement (x,y rotation side)
ADC  1.27,54.67 0 top
C1  12.7,21.65 270 top
C2  32.38,33.08 0 top
C3  31.75,39.43 0 top
C4  15.56,21.65 90 top
C5  20.32,22.29 90 top
C6  20.32,49.28 0 top
C7  55.56,36.26 90 top
C8  39.69,35.62 270 top
C9  29.21,25.15 0 top
C10  29.84,47.05 0 top
C11  8.26,48.96 180 top
C18  8.26,20.38 270 top
C19  6.35,20.38 270 top
C20  29.21,23.56 180 top
C21  31.75,44.83 0 top
C22  2.22,42.29 0 top
C23  3.81,26.1 270 top
C24  5.08,30.54 270 top
C25  5.08,37.53 90 top
C26  13.97,49.28 0 top
C27  10.79,21.65 270 top
C301  33.66,6.1 0 top
C302  30.16,5.14 270 top
C303  33.66,3.56 180 top
C304  47.31,12.76 90 top
C305  50.16,12.76 270 top
C306  34.29,12.13 180 top
C308  49.53,5.46 0 top
C309  49.21,3.56 0 top
C310  58.74,10.54 90 top
C311  58.74,17.53 270 top
C801  19.05,6.1 180 top
C802  19.05,1.65 180 top
HP  41.91,1.33 0 top
IC1  10.16,3.56 90 top
IC3  47.94,36.26 270 top
IN  49.53,1.33 0 top
JP1  1.27,44.51 90 top
JP2  6.35,10.22 270 top
JP3  1.27,14.03 90 top
L1  4.45,20.38 270 top
L2  49.85,52.45 180 top
L3  50.8,47.37 180 top
LED1  19.05,13.4 0 top
LED2  19.05,10.22 0 top
MCLK  43.5,13.72 180 top
MIC  57.15,1.33 180 top
OUT  36.83,1.33 0 top
PWR  31.75,1.33 0 top
PWR2  1.27,3.87 270 top
Q1  55.56,14.03 270 top
Q2  1.91,33.72 270 top
R4  49.85,49.28 180 top
R5  49.85,50.86 180 top
R9  13.97,51.18 0 top
R10  31.43,52.13 180 top
R11  14.61,13.4 0 top
R12  14.61,10.22 0 top
R13  14.61,16.57 0 top
R300  24.13,13.4 180 top
R301  24.13,10.22 180 top
SWD  36.83,54.67 180 top
U2  41.27,7.68 270 top
U4  17.78,36.26 0 top
USB  39.37,54.67 0 top
USB1  57.8,50.55 90 top
USB2  21.59,54.67 180 top
V  46.99,1.33 0 top
VBAT  5.08,41.66 90 top

### Tracks (layer width: path | path; a pad name or v marks a point on that pad's centre or on a via)
+3V3  (via drill 0.5, 0.5 pad 0.5)
  Top 0.203: U4.72 26.59,25.54 | 28.04,24.83 C9.1 | 31.29,33.01 C2.1 | C5.1 20.32,21.02 | C26.1 13.12,49.17 | 55.75,35.86 C7.1 | 23.28,12.98 R300.2 22.23,12.34 v22.23,11.81 22.23,11.28 R301.2 | R11.1 v12.7,13.4 | R10.2 v29.53,52.13 | v5.4,40.39 VBAT.1
  Top 0.305: 26.59,25.54 v27.3,24.83 28.04,24.83 | 31.29,33.01 U4.84 27.38,33.01 v26.67,33.72 | U4.62 21.54,22.66 C5.1 | 20.32,21.02 v20.95,20.38 | U4.95 29.99,38.52 C3.1 30.16,39.43 v29.84,39.75 | U4.52 16.54,21.78 C4.1 v15.56,19.75 | 13.12,49.17 13.97,48.32 15.24,48.32 15.52,48.04 U4.131 | C26.1 v12.06,49.28 | 5.29,36.36 C25.1 5.74,37.02 U4.17 | C1.1 C27.1 v10.79,23.56 10.03,24.32 U4.39 | v19.68,45.47 20.52,45.99 U4.121 20.52,48.22 C6.1 | U4.30 5.96,30.52 C24.1 v5.08,32.45 | U4.144 9.04,49.21 C11.1 | C11.1 8.89,49.28 | U4.108 28.5,45.71 v28.57,45.78 29,46.2 C10.1 | C11.1 9.11,49.81 v9.21,49.91
  Top 0.406: v43.5,36.89 43.26,36.66 IC3.11 39.87,36.66 C8.1 | L1.2 v4.45,18.48 | IC3.33 55.75,35.86 | C7.1 v55.56,34.35 | v40.32,6.73 39.37,7.68 U2.P$8 | v39.37,12.13 39.27,12.23 U2.P$1 35.24,12.23 C306.1 | C301.1 v31.75,6.1 30.61,6.1 C302.1 | C25.1 v4.45,35.94 | U2.P$27 47,11.58 C304.1 48.16,11.91 v48.26,11.81 49.82,11.81 C305.+ | 34.73,3.78 C303.1 v35.88,3.56 36.1,3.78 U2.P$14
  Top 0.813: C802.+ 17.46,1.65 15.56,3.56 v14.92,3.56 14.9,3.58 IC1.2
  Bottom 0.61: v40.32,6.73 v40.32,9.27
  pour Power: -0.64,56.58 -0.64,8.32 60.33,8.32 60.33,56.58
  pour Power: -0.64,7.68 -0.64,-1.21 25.08,-1.21 25.08,3.56 25.72,3.56 25.72,-1.21 60.33,-1.21 60.33,7.68 25.72,7.68 25.72,4.83 25.08,4.83 25.08,7.68
+5V
  Top 0.813: PWR.1 26.35,4.19 18.73,4.19 17.75,5.17 C801.+ 17.52,5.87 IC1.3 12.76,6.41 PWR2.1
ADC1  (via drill 0.5)
  Top 0.203: U4.26 8.31,32.5 9.21,33.4 v10.79,33.4
  Bottom 0.203: v10.79,33.4 10.16,34.04 10.16,53.4 ADC.4
ADC2  (via drill 0.5)
  Top 0.203: U4.27 8.46,32.02 8.89,32.45 v10.16,32.45
  Bottom 0.203: v10.16,32.45 9.53,33.08 9.53,48.32 6.35,51.5 ADC.3
ADC3  (via drill 0.5)
  Top 0.203: U4.28 9.22,31.51 v9.53,31.5
  Bottom 0.203: v9.53,31.5 8.89,32.13 8.89,45.15 3.81,50.23 ADC.2
ADC4  (via drill 0.5)
  Top 0.203: U4.29 8.43,31 v8.89,30.54
  Bottom 0.203: v8.89,30.54 8.26,31.18 8.26,45.15 3.17,50.23 3.17,52.77 ADC.1
BOOT0
  Top 0.203: U4.138 12.04,48.03 11.11,48.96 11.11,50.23 12.06,51.18 R9.1 16.51,54.57 USB2.3
CLKOUT  (via drill 0.5)
  Top 0.203: U2.P$2 38.65,11.58 39.05,11.18 v40.64,11.18 | 42.55,13.65 41.66,13.65 v41.59,13.72
  Top 0.406: MCLK.3 42.55,13.65
  Bottom 0.203: v40.64,11.18 40.64,11.81 41.59,12.76 v41.59,13.72
GND  (via drill 0.5, 0.5 pad 0.5)
  Top 0.203: C27.2 10.38,20.8 | 20.32,23.56 C5.2 | 55.75,36.66 C7.2 | R9.2 v15.88,51.18 | LED2.C v21.59,10.22 | LED1.C v21.59,13.4 | R13.1 13.02,16.57 v12.7,16.26
  Top 0.254: C25.2 5.08,38.48
  Top 0.305: v31.11,23.56 C20.1 C9.2 | 20.32,23.56 21.03,24.27 U4.61 21.03,26.49 v21.59,27.05 | C4.2 16.03,22.97 U4.51 16.03,26.89 v16.19,27.05 | 15.24,49.28 16.03,48.49 U4.130 | U4.38 v9.53,23.56 9.84,23.24 9.84,21.34 10.38,20.8 | U4.94 31.6,38.01 32.6,39.01 C3.2 33.34,39.43 v33.66,39.75 | C27.2 C1.2 | 34.55,5.73 C301.2 | C26.2 15.24,49.28 | 15.24,49.28 v15.88,49.28 | C22.2 v3.81,43.24 | U4.31 5.4,30.01 C24.2 v5.08,28.64 | C23.2 v2.86,25.46 | C11.2 7.62,49.28 | C11.2 v6.35,48.96 | U4.107 29.53,44.51 29.84,44.83 v29.84,45.78 30.7,46.63 C10.2 | C2.2 32.28,32.13 30.48,32.13 30.11,32.5 U4.83 26.72,32.5 v26.67,32.45 | v21.59,45.47 21.03,46.02 U4.120 21.03,49.14 C6.2 | C21.2 32.6,45.25 v32.07,45.78 | C311.2 v58.74,15.62 | C310.2 v58.74,12.45 | U4.143 9.53,45.78 9.21,45.47 8.57,45.47 7.3,46.74 7.3,48.86 C11.2 | U4.16 6.06,37.5 5.18,38.38 C25.2
  Top 0.406: v43.5,35.62 43.26,35.86 IC3.12 41.51,35.86 40.42,34.77 C8.2 | IC3.34 55.75,36.66 | C7.2 v55.56,38.16 | U2.P$21 42.55,7.68 v41.59,6.73 | U2.P$22 42.53,8.33 v41.59,9.27 | 5.08,38.48 v4.76,39.43 | v6.35,18.48 C19.2 C18.2 | C306.2 v32.38,12.13 | U2.P$28 45.93,12.23 C304.2 47.84,13.61 v48.26,14.03 49.72,14.03 49.75,14.06 C305.- | v49.53,5.46 C308.2 50.93,4.42 C309.2 | C303.2 v31.75,3.56 30.29,3.56 C302.2 | U2.P$11 35.92,5.73 v35.88,5.78 35.56,6.1 C301.2 | U2.P$15 46.45,3.78 v46.67,3.56 | L3.2 v48.9,47.37
  Top 0.813: v14.92,1.33 13.35,1.33 IC1.1 | C801.- v21.91,6.1 | C802.- v21.91,1.65
  Bottom 0.61: v41.59,6.73 v41.59,9.27
  pour Ground: -0.64,8.32 -0.64,56.58 60.33,56.58 60.33,8.32
  pour Ground: -0.64,7.68 -0.64,-1.21 25.08,-1.21 25.08,3.56 25.72,3.56 25.72,-1.21 60.33,-1.21 60.33,7.68 25.72,7.68 25.72,4.83 25.08,4.83 25.08,7.68
I2C_SCL  (via drill 0.5)
  Top 0.203: U4.69 25.02,23.94 v25.72,23.24 | U2.P$24 43.45,9.63 42.55,10.54 42.55,11.49 40.01,14.03 28.89,14.03 28.26,13.4 v26.04,13.4 | v26.04,13.4 R300.1 24.98,13.3 v26.04,13.4
  Bottom 0.203: v25.72,23.24 26.04,22.92 v26.04,13.4
I2C_SDA  (via drill 0.5)
  Top 0.203: U4.70 25.53,26.29 v24.77,27.05 | U2.P$23 43.15,8.98 41.91,10.22 41.91,11.18 39.69,13.4 29.21,13.4 v26.04,10.22 R301.1
  Bottom 0.203: v24.77,27.05 25.4,26.42 25.4,24.83 26.99,23.24 26.99,11.18 v26.04,10.22
I2S_LRCK  (via drill 0.5)
  Top 0.203: U4.73 31.91,27.52 v32.38,27.05 | v30.48,9.59 31.73,8.33 U2.P$7 37.54,8.32 38.73,8.32 39.05,8.64 39.05,9.27 38.69,9.63 U2.P$5
  Bottom 0.203: v30.48,9.59 30.48,12.45 31.43,13.4 31.43,22.61 32.38,23.56 v32.38,27.05
I2S_MCLK  (via drill 0.5)
  Top 0.203: U4.96 26.87,39 v25.08,37.21 | v27.94,14.35 28.26,14.67 43.18,14.67 43.5,14.35 MCLK.2
  Bottom 0.203: v25.08,37.21 25.08,28 26.04,27.05 26.04,24.83 27.94,22.92 v27.94,14.35
I2S_SCLK  (via drill 0.5)
  Top 0.203: U4.74 33.02,28 v33.66,27.37 | v31.43,11.18 31.68,10.93 U2.P$3
  Bottom 0.203: v31.43,11.18 31.43,12.45 32.38,13.4 32.38,22.61 33.66,23.88 v33.66,27.37
I2S_SDI  (via drill 0.5)
  Top 0.203: U2.P$6 33.69,8.98 v33.34,9.27 | U4.75 34.1,28.51 v34.61,28
  Bottom 0.203: v33.34,9.27 33.34,22.61 34.61,23.88 v34.61,28
I2S_SDO  (via drill 0.5)
  Top 0.203: U2.P$4 34.55,10.28 v34.29,9.91 | U4.76 34.86,29.02 35.56,28.32 v35.56,27.37
  Bottom 0.203: v34.29,9.91 34.29,22.61 35.56,23.88 v35.56,27.37
L_IN
  Top 0.406: U2.P$20 46.02,7.03 46.67,7.68 52.39,7.68 53.66,6.41 53.66,2.92 IN.2
L_OUT
  Top 0.406: U2.P$12 39.11,5.08 40.01,4.19 40.01,1.97 OUT.2
LHPOUT  (via drill 0.5)
  Top 0.406: v35.88,7.05 37.51,7.05 U2.P$9
  Bottom 0.406: v35.88,7.05 38.1,7.05 41.91,3.24 42.55,3.24 HP.2
MICBIAS  (via drill 0.5)
  Top 0.406: U2.P$17 43.24,5.08 v43.18,5.14
  Bottom 0.406: v43.18,5.14 43.81,4.51 51.44,4.51 MIC.2
MICIN  (via drill 0.5)
  Top 0.406: U2.P$18 43.86,5.73 v43.18,6.41
  Bottom 0.406: v43.18,6.41 53.98,6.41 57.15,3.24 MIC.1
N$2
  Top 0.305: U2.P$26 47.55,10.93 48.58,9.91 51.44,9.91 53.34,11.81 53.34,15.05 55.56,17.27 Q1.1 58.25,18.86 C311.1
N$10
  Top 0.203: R11.2 LED1.A
N$11
  Top 0.203: R12.2 LED2.A
N$17
  Top 0.203: USB1.3 52.07,50.55 50.8,49.28 R4.1
N$21
  Top 0.203: R5.1 50.8,50.86 51.1,51.2 USB1.2
N$23
  Top 0.305: C23.1 1.91,28.22 Q2.2 1.91,31.81 3.61,33.52 U4.24
N$24
  Top 0.203: 1.91,39.22 1.91,41.76 C22.1
  Top 0.305: U4.23 3.53,34 1.91,35.62 Q2.1 | Q2.1 1.91,38.16 | Q2.1 1.91,39.22
NRST  (via drill 0.5)
  Top 0.203: U4.25 8.18,33.01 9.53,34.35 21.27,34.35 v21.59,34.04
  Bottom 0.203: v21.59,34.04 21.91,34.35 21.91,44.2 24.45,46.74 24.45,52.45 SWD.5
PA0  (via drill 0.5)
  Top 0.203: v2.86,22.92 3.17,22.92 5.08,24.83 5.08,27.69 5.91,28.51 U4.34
  Bottom 0.203: v2.86,22.92 2.54,22.61 2.54,20.38 JP3.3
PA1
  Top 0.203: U4.35 6.03,28 5.71,27.69 5.71,24.83 2.86,21.97 2.86,18.16 JP3.2
PA2
  Top 0.203: 6.99,27.44 U4.36 6.35,26.81 6.35,24.83 3.49,21.97 3.49,14.35 1.27,12.13 JP2.9
PA3
  Top 0.203: 8.97,25.54 U4.37 9.04,24.66 8.57,24.19 8.57,22.91 9.21,22.28 9.21,18.8 2.54,12.13 2.54,10.22 JP2.10
PA4  (via drill 0.5)
  Top 0.203: U4.40 10.54,26.67 9.84,27.37 v9.53,27.37
  Bottom 0.203: v9.53,27.37 7.94,25.78 7.94,24.51 5.4,21.97 5.4,16.26 3.49,14.35 1.59,14.35 JP3.1
PA5  (via drill 0.5)
  Top 0.203: U4.41 11.02,28.41 v10.16,29.27
  Bottom 0.203: JP2.8 2.54,10.22 2.54,12.13 3.17,12.76 3.81,12.76 11.75,20.7 11.75,27.69 v10.16,29.27
PA6  (via drill 0.5)
  Top 0.203: U4.42 11.53,29.49 v11.11,29.91
  Bottom 0.203: JP2.7 3.81,12.13 12.38,20.7 12.38,28.64 v11.11,29.91
PA7  (via drill 0.5)
  Top 0.203: U4.43 12.04,30.2 v12.06,30.54
  Bottom 0.203: JP2.6 5.08,10.22 5.08,12.76 13.02,20.7 13.02,29.27 12.06,30.23 v12.06,30.54
PB0  (via drill 0.5)
  Top 0.203: U4.46 13.54,26.94 14.92,28.32 v14.92,29.91
  Bottom 0.203: v14.92,29.91 14.92,20.38 8.89,14.35 JP2.3
PB1  (via drill 0.5)
  Top 0.203: U4.47 13.97,25.59 13.97,26.73 15.88,28.64 v15.88,29.27 | R12.1 12.7,10.22 JP2.2
  Bottom 0.203: v15.88,29.27 15.88,28.64 17.14,27.37 17.14,20.07 14.92,17.84 13.34,17.84 10.16,14.67 10.16,9.91 JP2.2
PB2  (via drill 0.5)
  Top 0.203: U4.48 14.61,25.62 14.61,26.73 16.51,28.64 v17.14,28.64 | R13.2 15.56,16.57 v16.51,15.62
  Bottom 0.203: JP2.1 11.43,13.72 12.38,14.67 15.56,14.67 v16.51,15.62 17.78,16.89 17.78,28 v17.14,28.64
PB6  (via drill 0.5)
  Top 0.203: U4.136 13.03,45.77 v13.34,45.47
  Bottom 0.203: v13.34,45.47 13.34,54.04 USB2.4
PB7  (via drill 0.5)
  Top 0.203: U4.137 12.52,45.92 v12.06,45.47
  Bottom 0.203: v12.06,45.47 11.43,45.47 10.79,46.1 10.79,54.04 USB2.5
PC4  (via drill 0.5)
  Top 0.203: U4.44 12.52,29.41 13.02,29.91 v13.02,31.18
  Bottom 0.203: JP2.5 6.35,13.4 13.65,20.7 13.65,29.27 13.02,29.91 v13.02,31.18
PC5  (via drill 0.5)
  Top 0.203: U4.45 13.03,28.97 13.97,29.91 v13.97,30.54
  Bottom 0.203: v13.97,30.54 13.97,29.59 14.29,29.27 14.29,20.7 7.62,14.03 7.62,9.91 JP2.4
PD0  (via drill 0.5)
  Top 0.203: IC3.9 37.05,38.26 35.56,39.75 v34.92,39.75 | U4.114 24.03,45.89 v24.77,45.15
  Bottom 0.203: v24.77,45.15 24.45,44.83 24.45,41.02 26.67,38.8 33.97,38.8 v34.92,39.75
PD1  (via drill 0.5)
  Top 0.203: IC3.10 37.22,37.46 36.2,38.48 v34.92,38.48 | U4.115 23.52,43.9 v23.5,43.88
  Bottom 0.203: v34.92,38.48 34.61,38.16 26.04,38.16 23.5,40.7 v23.5,43.88
PD2  (via drill 0.5)
  Top 0.203: v20.95,43.88 23.04,45.96 U4.116
  Bottom 0.203: v20.95,43.88 22.54,45.47 22.54,53.72 USB2.1
PD4  (via drill 0.5)
  Top 0.203: v23.5,50.86 25.4,50.86 26.04,50.23 28.89,50.23 29.21,49.91 38.1,49.91 39.05,48.96 43.81,48.96 46.67,46.1 54.29,46.1 55.24,45.15 55.24,43.24 54.26,42.26 IC3.41 | U4.118 22.02,47.8 22.54,48.32 v23.5,48.32
  Bottom 0.203: v23.5,48.32 v23.5,50.86
PD5  (via drill 0.5)
  Top 0.203: IC3.17 43.54,31.86 44.77,33.08 v44.77,36.26 | U4.119 21.54,47.96 22.86,49.28 25.72,49.28 26.04,48.96 28.89,48.96 29.21,48.64 38.1,48.64 39.05,47.69 42.86,47.69 v44.77,45.78
  Bottom 0.203: v44.77,36.26 v44.77,45.78
PD8  (via drill 0.5)
  Top 0.203: U4.77 38.51,29.5 v39.05,28.96 | IC3.36 52.16,38.26 v46.04,32.13
  Bottom 0.203: v46.04,32.13 45.4,31.5 42.86,31.5 41.27,29.91 40.01,29.91 v39.05,28.96
PD9  (via drill 0.5)
  Top 0.203: U4.78 38.84,30.01 v39.05,30.23 | IC3.37 51.7,39.06 v46.04,33.4
  Bottom 0.203: v39.05,30.23 40.01,31.18 41.27,31.18 42.55,32.45 43.5,32.45 44.45,33.4 v46.04,33.4
PD10  (via drill 0.5)
  Top 0.203: U4.79 38.08,30.52 v39.05,31.5 | IC3.38 51.23,39.86 v46.04,34.67
  Bottom 0.203: v46.04,34.67 44.45,34.67 42.86,33.08 41.91,33.08 41.27,32.45 40.01,32.45 v39.05,31.5
PD11  (via drill 0.5)
  Top 0.203: U4.80 37.29,31 v37.78,31.5 | v38.1,45.47 38.42,45.15 41.59,45.15 41.91,45.47 42.86,45.47 44.45,43.88 53.52,43.88 IC3.43
  Bottom 0.203: v37.78,31.5 37.78,40.39 38.1,40.7 v38.1,45.47
PD12  (via drill 0.5)
  Top 0.203: U4.81 23.16,31.51 v22.54,32.13 | v25.4,48.32 28.89,48.32 29.21,48.01 38.1,48.01 39.05,47.05 42.23,47.05 44.62,44.66 IC3.44
  Bottom 0.203: v22.54,32.13 22.54,44.2 25.4,47.05 v25.4,48.32
PD13  (via drill 0.5)
  Top 0.203: IC3.28 52.43,31.86 49.85,29.27 49.85,25.46 46.67,22.29 39.05,22.29 v38.73,21.97 | U4.82 29.64,32.02 30.16,31.5 32.7,31.5 33.34,32.13 v36.83,32.13
  Bottom 0.203: v36.83,32.13 36.83,29.91 38.42,28.32 38.42,22.29 v38.73,21.97
PD14  (via drill 0.5)
  Top 0.203: U4.85 30.28,33.52 30.8,34.04 33.97,34.04 34.29,33.72 36.51,33.72 37.47,32.77 v38.73,32.77 | IC3.7 v38.84,39.86
  Bottom 0.203: v38.84,39.86 38.73,39.75 v38.73,32.77
PD15  (via drill 0.5, 0.5 pad 0.5)
  Top 0.203: IC3.8 37.41,39.06 v36.83,39.64 | U4.86 30.12,34 30.8,34.67 33.97,34.67 34.29,34.35 36.51,34.35 v36.83,34.67
  Bottom 0.203: v36.83,34.67 37.15,34.99 37.15,39.12 36.83,39.43 v36.83,39.64
PE0  (via drill 0.5)
  Top 0.203: v18.41,51.18 19.37,52.13 22.86,52.13 23.18,52.45 25.08,52.45 26.04,51.5 28.89,51.5 29.21,51.18 38.1,51.18 39.05,50.23 44.77,50.23 v46.67,48.32 | U4.141 10.54,45.4 11.43,44.51 16.83,44.51 v17.78,45.47 | IC3.39 47.67,40.66 v46.67,41.66
  Bottom 0.203: v46.67,41.66 v46.67,48.32 | v18.41,51.18 18.1,50.86 18.1,49.28 17.46,48.64 17.46,45.78 v17.78,45.47
PE1  (via drill 0.5)
  Top 0.203: v47.62,47.05 46.67,47.05 44.13,49.59 39.05,49.59 38.1,50.55 29.21,50.55 28.89,50.86 26.04,50.86 25.08,51.82 23.18,51.82 22.86,51.5 20.95,51.5 v20.64,51.18 | U4.142 10.03,44.96 11.11,43.88 19.68,43.88 v20.64,44.83 | IC3.40 48.77,41.46 v47.62,42.61
  Bottom 0.203: v47.62,42.61 v47.62,47.05 | v20.64,51.18 v20.64,44.83
PE2
  Top 0.203: JP1.4 1.27,51.5 7.06,45.71 U4.1
PE3
  Top 0.203: U4.2 6.03,44.51 1.27,49.28 JP1.3
PE4
  Top 0.203: U4.3 5.59,44.01 2.54,47.05 JP1.2
PE5
  Top 0.203: U4.4 5.14,43.5 4.13,44.51 JP1.1
PE7  (via drill 0.5)
  Top 0.203: U4.58 19.53,28.49 20.64,29.59 25.72,29.59 v26.04,29.91 | v29.84,36.89 30.48,37.53 36.51,37.53 38.1,35.94 38.1,34.04 38.42,33.72 40.32,33.72 41.66,35.06 IC3.13
  Bottom 0.203: v26.04,29.91 25.72,30.23 25.72,36.26 26.35,36.89 v29.84,36.89
PE8
  Top 0.203: IC3.14 41.81,34.26 40.01,32.45 40.01,28.64 38.73,27.37 36.83,27.37 35.56,26.1 32.07,26.1 31.43,26.73 27.94,26.73 25.72,28.96 20.95,28.96 20.04,28.04 U4.59
PE9
  Top 0.203: U4.60 20.52,27.57 21.27,28.32 25.4,28.32 27.62,26.1 31.43,26.1 32.07,25.46 35.56,25.46 36.83,26.73 39.05,26.73 40.64,28.32 40.64,32.13 41.97,33.46 IC3.15
PE10  (via drill 0.5)
  Top 0.203: v40.01,19.43 39.69,19.11 25.4,19.11 22.02,22.49 U4.63 | v40.96,27.37 41.27,27.69 41.27,32.13 41.8,32.66 IC3.16
  Bottom 0.203: v40.96,27.37 40.96,20.38 v40.01,19.43
PE11
  Top 0.203: IC3.29 52.28,32.66 49.21,29.59 49.21,25.78 46.35,22.92 37.47,22.92 34.29,19.75 25.4,19.75 22.53,22.62 U4.64
PE12
  Top 0.203: IC3.30 52.13,33.46 48.58,29.91 48.58,26.1 46.04,23.56 37.47,23.56 34.29,20.38 25.4,20.38 23.04,22.75 U4.65
PE13
  Top 0.203: IC3.31 51.98,34.26 47.94,30.23 47.94,26.42 45.72,24.19 37.47,24.19 34.29,21.02 25.4,21.02 23.52,22.9 U4.66
PE14
  Top 0.203: IC3.32 51.82,35.06 47.31,30.54 47.31,26.73 45.4,24.83 37.47,24.83 34.29,21.65 25.4,21.65 24.03,23.03 U4.67
PE15
  Top 0.203: IC3.35 52.63,37.46 46.67,31.5 46.67,27.05 45.09,25.46 37.47,25.46 34.29,22.29 25.4,22.29 24.54,23.15 U4.68
PF0  (via drill 0.5)
  Top 0.203: IC3.1 41.74,44.66 41.59,44.51 v37.15,44.51 | v25.72,44.2 22.02,40.5 U4.10
  Bottom 0.203: v37.15,44.51 35.88,44.51 35.56,44.2 v25.72,44.2
PF1  (via drill 0.5)
  Top 0.203: U4.11 22.81,40.02 v25.4,42.61 | IC3.2 42.32,43.88 37.78,43.88 37.47,43.56 v36.2,43.56
  Bottom 0.203: v36.2,43.56 26.35,43.56 v25.4,42.61
PF2  (via drill 0.5)
  Top 0.203: U4.12 23.57,39.51 v26.67,42.61 | IC3.3 37.6,43.06 37.15,42.61 v35.24,42.61
  Bottom 0.203: v26.67,42.61 v35.24,42.61
PF3  (via drill 0.5)
  Top 0.203: v34.29,41.66 37.15,41.66 37.75,42.26 IC3.4 | v26.67,41.34 24.33,39 U4.13
  Bottom 0.203: v26.67,41.34 26.99,41.66 v34.29,41.66
PF4  (via drill 0.5)
  Top 0.203: v26.67,40.07 25.12,38.52 U4.14 | IC3.5 37.9,41.46 37.15,40.7 v31.75,40.7
  Bottom 0.203: v26.67,40.07 27.3,40.7 v31.75,40.7
PF5  (via drill 0.5)
  Top 0.203: U4.15 17.3,38.01 20.32,34.99 v26.67,34.99 | v31.43,24.83 35.56,24.83 36.83,26.1 44.77,26.1 46.04,27.37 46.04,30.54 45.52,31.06 IC3.18
  Bottom 0.203: v31.43,24.83 30.8,25.46 30.8,34.04 29.84,34.99 v26.67,34.99
PF9  (via drill 0.5)
  Top 0.203: U4.21 5.69,35.01 v5.4,35.31
  Bottom 0.203: JP3.4 1.27,22.29 3.81,24.83 3.81,34.04 4.76,34.99 5.08,35.31 v5.4,35.31
PF10  (via drill 0.5)
  Top 0.203: U4.22 4.29,34.51 v3.49,35.31
  Bottom 0.203: JP3.5 1.27,33.08 v3.49,35.31
PF12  (via drill 0.5)
  Top 0.203: IC3.19 v45.05,30.26 | U4.50 15.52,24.47 14.29,23.24 14.29,19.43 18.41,15.3 44.13,15.3 v44.77,15.94
  Bottom 0.203: v45.05,30.26 45.09,29.59 45.09,26.73 44.77,26.42 v44.77,15.94
PF13  (via drill 0.5)
  Top 0.203: U4.53 17.02,17.97 19.05,15.94 43.18,15.94 v43.81,16.57 | IC3.20 v44.27,29.46
  Bottom 0.203: v44.27,29.46 44.45,29.27 44.45,27.05 43.81,26.42 v43.81,16.57
PF14  (via drill 0.5)
  Top 0.203: IC3.21 v43.48,28.66 | U4.54 17.53,18.73 19.68,16.57 42.23,16.57 v42.86,17.21
  Bottom 0.203: v43.48,28.66 43.5,27.05 43.18,26.73 43.16,18.18 43.16,17.55 v42.86,17.21
PF15  (via drill 0.5)
  Top 0.203: IC3.22 v42.34,26.94 | U4.55 18.03,19.49 20.32,17.21 41.27,17.21 v42.34,18.28
  Bottom 0.203: v42.34,26.94 v42.34,18.28
PG0
  Top 0.203: 53.51,27.86 IC3.23 53.02,27.34 53.02,23.88 48.26,19.11 41.91,19.11 40.64,17.84 20.95,17.84 18.54,20.26 U4.56
PG1
  Top 0.203: IC3.24 53.04,28.66 52.39,28 52.39,24.19 47.94,19.75 41.59,19.75 40.32,18.48 21.59,18.48 19.02,21.04 U4.57
PG2  (via drill 0.5)
  Top 0.203: IC3.25 52.89,29.46 51.75,28.32 51.75,24.51 47.62,20.38 39.69,20.38 39.05,19.75 36.2,19.75 v35.88,20.07 | U4.87 30,34.51 30.8,35.31 v34.29,35.31
  Bottom 0.203: v34.29,35.31 34.61,34.99 34.61,30.23 36.51,28.32 36.51,23.56 35.88,22.92 v35.88,20.07
PG3  (via drill 0.5)
  Top 0.203: IC3.26 52.74,30.26 51.12,28.64 51.12,24.83 47.31,21.02 39.69,21.02 39.05,20.38 37.15,20.38 v36.83,20.7 | U4.88 29.87,35.01 31.11,36.26 34.92,36.26 v35.24,35.94
  Bottom 0.203: v36.83,20.7 36.83,22.61 37.15,22.92 37.15,28.32 35.24,30.23 v35.24,35.94
PG4  (via drill 0.5)
  Top 0.203: IC3.27 52.59,31.06 50.48,28.96 50.48,25.15 46.99,21.65 39.69,21.65 39.05,21.02 38.1,21.02 v37.78,21.34 | U4.89 29.72,35.5 31.11,36.89 35.88,36.89 v36.2,36.58
  Bottom 0.203: v37.78,21.34 37.78,28.32 35.88,30.23 35.88,34.99 36.2,35.31 v36.2,36.58
PG5  (via drill 0.5)
  Top 0.203: U4.90 20.57,36 v20.32,36.26 | v19.37,50.55 19.68,50.23 22.23,50.23 22.54,49.91 25.72,49.91 26.04,49.59 28.89,49.59 29.21,49.28 38.1,49.28 39.05,48.32 43.5,48.32 46.35,45.47 53.98,45.47 54.61,44.83 54.61,43.56 54.11,43.06 IC3.42
  Bottom 0.203: v20.32,36.26 18.73,37.85 18.73,49.91 v19.37,50.55
PG10  (via drill 0.5)
  Top 0.203: U4.125 18.54,48.2 17.46,49.28 17.46,51.5 18.73,52.77 22.86,52.77 23.18,53.09 31.33,53.09 R10.1 32.6,51.82 38.1,51.82 38.73,51.18 v40.01,51.18 | IC3.6 40.05,40.66 v40.01,40.7
  Bottom 0.203: v40.01,51.18 v40.01,40.7
PG14
  Top 0.203: U4.129 16.54,48.35 16.83,48.64 16.83,53.09 18.41,54.67 USB2.2
R_IN
  Top 0.406: U2.P$19 46.64,6.38 47.31,7.05 51.75,7.05 52.7,6.1 52.7,4.19 49.85,1.33 IN.1
R_OUT
  Top 0.406: U2.P$13 38.81,4.43 39.05,4.19 39.05,3.24 37.15,1.33 OUT.1
RHPOUT
  Top 0.406: U2.P$10 38.77,6.38 41.91,3.24 HP.1
SWCLK  (via drill 0.5)
  Top 0.203: U4.109 27.55,46.98 v27.62,47.05
  Bottom 0.203: v27.62,47.05 27.62,52.13 28.89,53.4 33.02,53.4 SWD.2
SWDIO  (via drill 0.5)
  Top 0.203: U4.105 27.69,43.5 26.67,44.51 v26.67,45.47
  Bottom 0.203: SWD.4 26.67,52.13 v26.67,45.47
SWO  (via drill 0.5)
  Top 0.203: U4.133 14.53,45.86 14.92,45.47 v16.51,45.47 | SWD.6 22.86,53.4 18.1,53.4 v17.78,53.09
  Bottom 0.203: v17.78,53.09 16.83,52.13 16.83,45.78 v16.51,45.47
USB_DM  (via drill 0.5)
  Top 0.203: U4.103 32.6,42.51 34.29,44.2 34.29,44.83 v34.61,45.15 | R5.2 48.26,50.86 USB.3
  Bottom 0.203: v34.61,45.15 35.88,45.15 37.47,46.74 37.47,50.55 39.69,52.77 42.55,52.77 USB.3
USB_DP  (via drill 0.5)
  Top 0.203: U4.104 32.47,43.01 33.66,44.2 33.66,45.47 v34.61,46.42 | v34.61,52.77 v38.1,52.77 | R4.2 47.94,49.28 42.55,54.67 USB.2
  Bottom 0.203: v34.61,46.42 v34.61,52.77 | v38.1,52.77 38.73,53.4 40.32,53.4 41.59,54.67 USB.2
USB_GND
  Top 0.406: L3.1 52.7,47.37 53.66,48.32 USB1.G3 55.2,48.59 USB1.5
  Top 0.61: USB.5 53.3,54.67 USB1.G4
  Bottom 0.61: USB1.G 57.15,46.37 USB1.G3 USB1.G4 57.15,54.72 USB1.G2
USB_ID  (via drill 0.5)
  Top 0.203: U4.102 32.73,42 35.56,44.83 v35.56,47.05 | USB1.4 53.33,49.9 51.75,48.32 47.94,48.32 42.86,53.4 40.96,53.4 39.69,54.67 USB.1
  Bottom 0.203: v35.56,47.05 35.56,52.77 36.2,53.4 37.47,53.4 38.73,54.67 USB.1
USB_VBUS
  Top 0.203: 55.81,51.8 55.29,51.8 55.24,51.75
  Top 0.305: USB1.1 55.81,51.8 52.41,51.8 51.75,52.45 L2.1 49.74,53.4 48.58,53.4 47.31,54.67 USB.4
  Top 0.406: 50.48,52.67 L2.1
VBAT
  Top 0.203: U4.6 5.42,42.51 VBAT.2
VBUS  (via drill 0.5)
  Top 0.203: U4.101 32.88,41.52 37.78,46.42 40.96,46.42 v41.27,46.1
  Top 0.305: L2.2 v47.94,52.45
  Bottom 0.203: v41.27,46.1 41.59,46.1 v47.94,52.45
VCAP1
  Top 0.305: U4.71 26.04,24.19 26.67,23.56 C20.2
VCAP2
  Top 0.305: U4.106 30.07,44.01 C21.1
VCC/2
  Top 0.406: U2.P$16 46.28,4.43 46.99,5.14 47.81,5.14 C308.1 48.36,5.23 C309.1 46.99,2.18 V.1
VDDA
  Top 0.305: U4.32 U4.33 7.32,29.27 7.94,29.27 8.26,28.96 8.26,27.05 7.3,26.1 7.3,24.83 4.45,21.97 4.45,21.34 | 4.55,21.23 4.45,21.34 | 4.45,21.34 L1.1
  Top 0.406: C18.1 C19.1 L1.1
XTI
  Top 0.203: U2.P$25 43.76,10.28 43.18,10.86 43.18,12.31 44.39,13.52 MCLK.1
  Top 0.305: U2.P$25 47.25,10.28 48.32,9.21 Q1.2 58.25,9.21 C310.1

### Text on the board
tPlace: gnd | BOOT0 | PG14 | PD2 | PB7 | PB6 | PE2 | PE3 | PE4 | PE5 | PF10 | PF9 | PA0 | OWL Rev06 | Rebel Technology | PA1 | PA2 | PA6 | PC4 | PB0 | PB2 | PA3 | PA5 | PA7 | PC5 | PB1 | PA4 | 5v | gnd | 3v3 | 5v
bPlace: OWL Rev06 | Rebel Technology